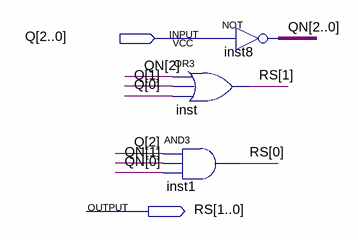
[diagram p0: schematic sheet]
// Quartus schematic RS.bdf as structural Verilog: 3 symbols, 2 pins
module RS (
  input  [2:0] Q,
  output [1:0] RS
);

  wire [2:0] QN;

  assign QN = ~Q;  // NOT inst8, 3 bits wide
  or inst (RS[1], QN[2], Q[1], Q[0]);
  and inst1 (RS[0], Q[2], QN[1], QN[0]);
endmodule
